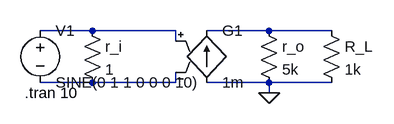
[diagram p0: schematic vccs.asc]
vccs.asc, the LTspice schematic file:
Version 4
SHEET 1 880 680
WIRE 48 80 -32 80
WIRE 176 80 48 80
WIRE 320 80 224 80
WIRE 416 80 320 80
WIRE 176 96 176 80
WIRE 48 160 -32 160
WIRE 176 160 176 144
WIRE 176 160 48 160
WIRE 320 160 224 160
WIRE 416 160 320 160
WIRE 320 176 320 160
FLAG 320 176 0
SYMBOL g 224 64 R0
SYMATTR InstName G1
SYMATTR Value 1m
SYMBOL res 32 64 R0
SYMATTR InstName r_i
SYMATTR Value 1
SYMBOL voltage -32 64 R0
WINDOW 123 0 0 Left 0
WINDOW 39 0 0 Left 0
SYMATTR InstName V1
SYMATTR Value SINE(0 1 1 0 0 0 10)
SYMBOL res 304 64 R0
SYMATTR InstName r_o
SYMATTR Value 5k
SYMBOL res 400 64 R0
SYMATTR InstName R_L
SYMATTR Value 1k
TEXT -56 176 Left 2 !.tran 10

The netlist it stands for:
* vccs.asc
G1 0 N002 N001 N003 1m
r_i N001 N003 1
V1 N001 N003 SINE(0 1 1 0 0 0 10)
r_o N002 0 5k
R_L N002 0 1k
.tran 10
.backanno
.end